# Altium schematic sheet MCU063A_GPIO.SchDoc
size 431 x 279 mm; Date: Not shown in title block; ApprovedBy: Not shown in title block; CheckedBy: Not shown in title block; Author: Not shown in title block; CompanyName: Not shown in title block; DrawnBy: Cody Watkins; Engineer: Not shown in title block; Organization: Not shown in title block; Address1: Not shown in title block; Address2: Not shown in title block; Address3: Not shown in title block; Address4: Not shown in title block; DocumentNumber: 2; Revision: Use project parameter SCH_Rev; SheetNumber: 2; SheetTotal: 11; PageSetup: Record=PageOptions|CenterHorizontal=True|CenterVertical=True|PrintScale=1.00|XCorrection=1.00|YCorrection=1.00|PrintKind=0|BorderSize=5000000|LeftOffset=0|BottomOffset=0|Orientation=2|PaperLength=1000|PaperWidth=1000|Scale=100|PaperSource=15|PrintQuality=600|MediaType=1|DitherType=10|PaperKind=Letter|PrintScaleMode=1; CurrentTime: Not shown in title block; CurrentDate: Not shown in title block; Time: Not shown in title block; DocumentFullPathAndName: Not shown in title block; DocumentName: Not shown in title block; ModifiedDate: Not shown in title block; ImagePath: Not shown in title block
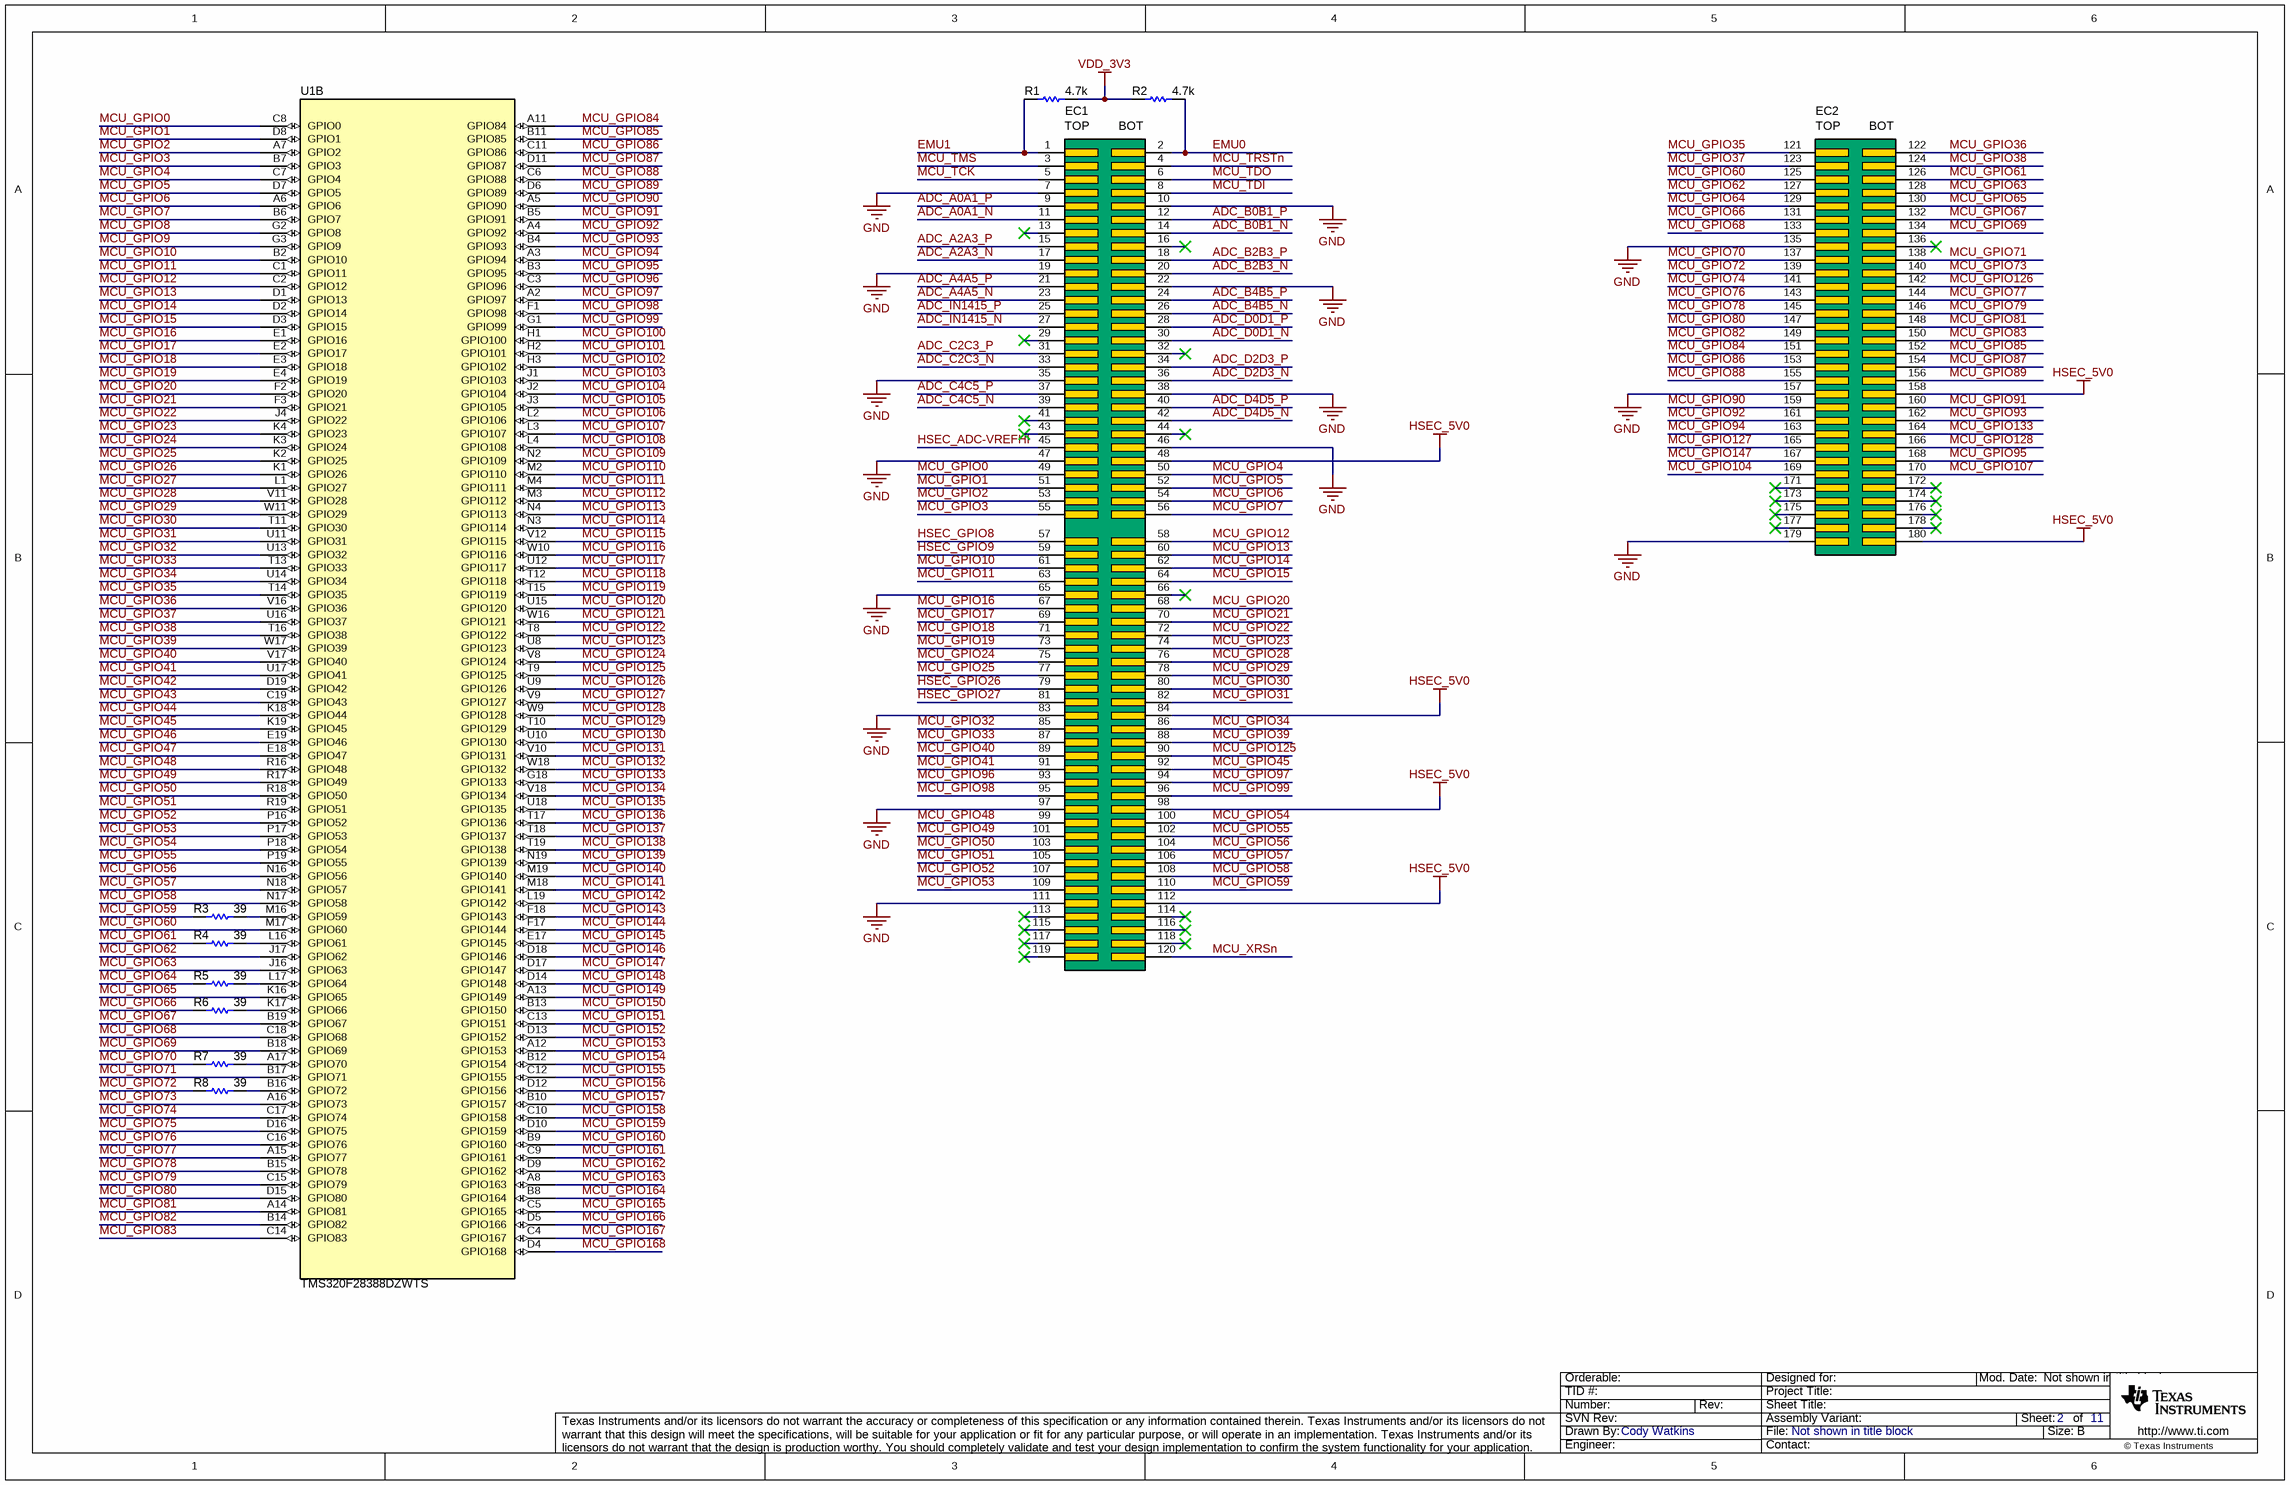
[diagram p0: MCU063A_GPIO.SchDoc]

## Parts
EC1  controlCARD-120HSEC_Edge  [controlCARD-120HSEC_Edge]  (value not drawn)  (no BOM)
EC2  controlCARD-180HSEC-60pinAddon_Edge  [controlCARD-180HSEC-60pinAddon_Edge]  (value not drawn)  (no BOM)
R1  ValueDisplayed: 4.7k  [0402]  (hidden comment: CRCW04024K70JNED)
R2  ValueDisplayed: 4.7k  [0402]  (hidden comment: CRCW04024K70JNED)
R3  ValueDisplayed: 39  [0402]  (hidden comment: CRCW040239R0JNED)
R4  ValueDisplayed: 39  [0402]  (hidden comment: CRCW040239R0JNED)
R5  ValueDisplayed: 39  [0402]  (hidden comment: CRCW040239R0JNED)
R6  ValueDisplayed: 39  [0402]  (hidden comment: CRCW040239R0JNED)
R7  ValueDisplayed: 39  [0402]  (hidden comment: CRCW040239R0JNED)
R8  ValueDisplayed: 39  [0402]  (hidden comment: CRCW040239R0JNED)
U1  TMS320F28388DZWTS  [ZWT0337A]  (part B of 5)

## Nets
GND: EC1.7 EC1.10 EC1.19 EC1.22 EC1.35 EC1.38 EC1.46 EC1.47 EC1.65 EC1.83 EC1.97 EC1.111 EC2.135 EC2.157 EC2.179
HSEC_5V0: EC1.48 EC1.84 EC1.98 EC1.112 EC2.158 EC2.180
VDD_3V3: R1.2 R2.1
ADC_A0A1_N: EC1.11
ADC_A0A1_P: EC1.9
ADC_A2A3_N: EC1.17
ADC_A2A3_P: EC1.15
ADC_A4A5_N: EC1.23
ADC_A4A5_P: EC1.21
ADC_B0B1_N: EC1.14
ADC_B0B1_P: EC1.12
ADC_B2B3_N: EC1.20
ADC_B2B3_P: EC1.18
ADC_B4B5_N: EC1.26
ADC_B4B5_P: EC1.24
ADC_C2C3_N: EC1.33
ADC_C2C3_P: EC1.31
ADC_C4C5_N: EC1.39
ADC_C4C5_P: EC1.37
ADC_D0D1_N: EC1.30
ADC_D0D1_P: EC1.28
ADC_D2D3_N: EC1.36
ADC_D2D3_P: EC1.34
ADC_D4D5_N: EC1.42
ADC_D4D5_P: EC1.40
ADC_IN1415_N: EC1.27
ADC_IN1415_P: EC1.25
EMU0: EC1.2 R2.2
EMU1: EC1.1 R1.1
HSEC_ADC-VREFHI: EC1.45
HSEC_GPIO8: EC1.57
HSEC_GPIO9: EC1.59
HSEC_GPIO26: EC1.79
HSEC_GPIO27: EC1.81
MCU_GPIO0: EC1.49 U1.C8(GPIO0)
MCU_GPIO1: EC1.51 U1.D8(GPIO1)
MCU_GPIO2: EC1.53 U1.A7(GPIO2)
MCU_GPIO3: EC1.55 U1.B7(GPIO3)
MCU_GPIO4: EC1.50 U1.C7(GPIO4)
MCU_GPIO5: EC1.52 U1.D7(GPIO5)
MCU_GPIO6: EC1.54 U1.A6(GPIO6)
MCU_GPIO7: EC1.56 U1.B6(GPIO7)
MCU_GPIO8: U1.G2(GPIO8)
MCU_GPIO9: U1.G3(GPIO9)
MCU_GPIO10: EC1.61 U1.B2(GPIO10)
MCU_GPIO11: EC1.63 U1.C1(GPIO11)
MCU_GPIO12: EC1.58 U1.C2(GPIO12)
MCU_GPIO13: EC1.60 U1.D1(GPIO13)
MCU_GPIO14: EC1.62 U1.D2(GPIO14)
MCU_GPIO15: EC1.64 U1.D3(GPIO15)
MCU_GPIO16: EC1.67 U1.E1(GPIO16)
MCU_GPIO17: EC1.69 U1.E2(GPIO17)
MCU_GPIO18: EC1.71 U1.E3(GPIO18)
MCU_GPIO19: EC1.73 U1.E4(GPIO19)
MCU_GPIO20: EC1.68 U1.F2(GPIO20)
MCU_GPIO21: EC1.70 U1.F3(GPIO21)
MCU_GPIO22: EC1.72 U1.J4(GPIO22)
MCU_GPIO23: EC1.74 U1.K4(GPIO23)
MCU_GPIO24: EC1.75 U1.K3(GPIO24)
MCU_GPIO25: EC1.77 U1.K2(GPIO25)
MCU_GPIO26: U1.K1(GPIO26)
MCU_GPIO27: U1.L1(GPIO27)
MCU_GPIO28: EC1.76 U1.V11(GPIO28)
MCU_GPIO29: EC1.78 U1.W11(GPIO29)
MCU_GPIO30: EC1.80 U1.T11(GPIO30)
MCU_GPIO31: EC1.82 U1.U11(GPIO31)
MCU_GPIO32: EC1.85 U1.U13(GPIO32)
MCU_GPIO33: EC1.87 U1.T13(GPIO33)
MCU_GPIO34: EC1.86 U1.U14(GPIO34)
MCU_GPIO35: EC2.121 U1.T14(GPIO35)
MCU_GPIO36: EC2.122 U1.V16(GPIO36)
MCU_GPIO37: EC2.123 U1.U16(GPIO37)
MCU_GPIO38: EC2.124 U1.T16(GPIO38)
MCU_GPIO39: EC1.88 U1.W17(GPIO39)
MCU_GPIO40: EC1.89 U1.V17(GPIO40)
MCU_GPIO41: EC1.91 U1.U17(GPIO41)
MCU_GPIO42: U1.D19(GPIO42)
MCU_GPIO43: U1.C19(GPIO43)
MCU_GPIO44: U1.K18(GPIO44)
MCU_GPIO45: EC1.92 U1.K19(GPIO45)
MCU_GPIO46: U1.E19(GPIO46)
MCU_GPIO47: U1.E18(GPIO47)
MCU_GPIO48: EC1.99 U1.R16(GPIO48)
MCU_GPIO49: EC1.101 U1.R17(GPIO49)
MCU_GPIO50: EC1.103 U1.R18(GPIO50)
MCU_GPIO51: EC1.105 U1.R19(GPIO51)
MCU_GPIO52: EC1.107 U1.P16(GPIO52)
MCU_GPIO53: EC1.109 U1.P17(GPIO53)
MCU_GPIO54: EC1.100 U1.P18(GPIO54)
MCU_GPIO55: EC1.102 U1.P19(GPIO55)
MCU_GPIO56: EC1.104 U1.N16(GPIO56)
MCU_GPIO57: EC1.106 U1.N18(GPIO57)
MCU_GPIO58: EC1.108 U1.N17(GPIO58)
MCU_GPIO59: EC1.110 R3.1
MCU_GPIO60: EC2.125 U1.M17(GPIO60)
MCU_GPIO61: EC2.126 R4.1
MCU_GPIO62: EC2.127 U1.J17(GPIO62)
MCU_GPIO63: EC2.128 U1.J16(GPIO63)
MCU_GPIO64: EC2.129 R5.1
MCU_GPIO65: EC2.130 U1.K16(GPIO65)
MCU_GPIO66: EC2.131 R6.1
MCU_GPIO67: EC2.132 U1.B19(GPIO67)
MCU_GPIO68: EC2.133 U1.C18(GPIO68)
MCU_GPIO69: EC2.134 U1.B18(GPIO69)
MCU_GPIO70: EC2.137 R7.1
MCU_GPIO71: EC2.138 U1.B17(GPIO71)
MCU_GPIO72: EC2.139 R8.1
MCU_GPIO73: EC2.140 U1.A16(GPIO73)
MCU_GPIO74: EC2.141 U1.C17(GPIO74)
MCU_GPIO75: U1.D16(GPIO75)
MCU_GPIO76: EC2.143 U1.C16(GPIO76)
MCU_GPIO77: EC2.144 U1.A15(GPIO77)
MCU_GPIO78: EC2.145 U1.B15(GPIO78)
MCU_GPIO79: EC2.146 U1.C15(GPIO79)
MCU_GPIO80: EC2.147 U1.D15(GPIO80)
MCU_GPIO81: EC2.148 U1.A14(GPIO81)
MCU_GPIO82: EC2.149 U1.B14(GPIO82)
MCU_GPIO83: EC2.150 U1.C14(GPIO83)
MCU_GPIO84: EC2.151 U1.A11(GPIO84)
MCU_GPIO85: EC2.152 U1.B11(GPIO85)
MCU_GPIO86: EC2.153 U1.C11(GPIO86)
MCU_GPIO87: EC2.154 U1.D11(GPIO87)
MCU_GPIO88: EC2.155 U1.C6(GPIO88)
MCU_GPIO89: EC2.156 U1.D6(GPIO89)
MCU_GPIO90: EC2.159 U1.A5(GPIO90)
MCU_GPIO91: EC2.160 U1.B5(GPIO91)
MCU_GPIO92: EC2.161 U1.A4(GPIO92)
MCU_GPIO93: EC2.162 U1.B4(GPIO93)
MCU_GPIO94: EC2.163 U1.A3(GPIO94)
MCU_GPIO95: EC2.168 U1.B3(GPIO95)
MCU_GPIO96: EC1.93 U1.C3(GPIO96)
MCU_GPIO97: EC1.94 U1.A2(GPIO97)
MCU_GPIO98: EC1.95 U1.F1(GPIO98)
MCU_GPIO99: EC1.96 U1.G1(GPIO99)
MCU_GPIO100: U1.H1(GPIO100)
MCU_GPIO101: U1.H2(GPIO101)
MCU_GPIO102: U1.H3(GPIO102)
MCU_GPIO103: U1.J1(GPIO103)
MCU_GPIO104: EC2.169 U1.J2(GPIO104)
MCU_GPIO105: U1.J3(GPIO105)
MCU_GPIO106: U1.L2(GPIO106)
MCU_GPIO107: EC2.170 U1.L3(GPIO107)
MCU_GPIO108: U1.L4(GPIO108)
MCU_GPIO109: U1.N2(GPIO109)
MCU_GPIO110: U1.M2(GPIO110)
MCU_GPIO111: U1.M4(GPIO111)
MCU_GPIO112: U1.M3(GPIO112)
MCU_GPIO113: U1.N4(GPIO113)
MCU_GPIO114: U1.N3(GPIO114)
MCU_GPIO115: U1.V12(GPIO115)
MCU_GPIO116: U1.W10(GPIO116)
MCU_GPIO117: U1.U12(GPIO117)
MCU_GPIO118: U1.T12(GPIO118)
MCU_GPIO119: U1.T15(GPIO119)
MCU_GPIO120: U1.U15(GPIO120)
MCU_GPIO121: U1.W16(GPIO121)
MCU_GPIO122: U1.T8(GPIO122)
MCU_GPIO123: U1.U8(GPIO123)
MCU_GPIO124: U1.V8(GPIO124)
MCU_GPIO125: EC1.90 U1.T9(GPIO125)
MCU_GPIO126: EC2.142 U1.U9(GPIO126)
MCU_GPIO127: EC2.165 U1.V9(GPIO127)
MCU_GPIO128: EC2.166 U1.W9(GPIO128)
MCU_GPIO129: U1.T10(GPIO129)
MCU_GPIO130: U1.U10(GPIO130)
MCU_GPIO131: U1.V10(GPIO131)
MCU_GPIO132: U1.W18(GPIO132)
MCU_GPIO133: EC2.164 U1.G18(GPIO133)
MCU_GPIO134: U1.V18(GPIO134)
MCU_GPIO135: U1.U18(GPIO135)
MCU_GPIO136: U1.T17(GPIO136)
MCU_GPIO137: U1.T18(GPIO137)
MCU_GPIO138: U1.T19(GPIO138)
MCU_GPIO139: U1.N19(GPIO139)
MCU_GPIO140: U1.M19(GPIO140)
MCU_GPIO141: U1.M18(GPIO141)
MCU_GPIO142: U1.L19(GPIO142)
MCU_GPIO143: U1.F18(GPIO143)
MCU_GPIO144: U1.F17(GPIO144)
MCU_GPIO145: U1.E17(GPIO145)
MCU_GPIO146: U1.D18(GPIO146)
MCU_GPIO147: EC2.167 U1.D17(GPIO147)
MCU_GPIO148: U1.D14(GPIO148)
MCU_GPIO149: U1.A13(GPIO149)
MCU_GPIO150: U1.B13(GPIO150)
MCU_GPIO151: U1.C13(GPIO151)
MCU_GPIO152: U1.D13(GPIO152)
MCU_GPIO153: U1.A12(GPIO153)
MCU_GPIO154: U1.B12(GPIO154)
MCU_GPIO155: U1.C12(GPIO155)
MCU_GPIO156: U1.D12(GPIO156)
MCU_GPIO157: U1.B10(GPIO157)
MCU_GPIO158: U1.C10(GPIO158)
MCU_GPIO159: U1.D10(GPIO159)
MCU_GPIO160: U1.B9(GPIO160)
MCU_GPIO161: U1.C9(GPIO161)
MCU_GPIO162: U1.D9(GPIO162)
MCU_GPIO163: U1.A8(GPIO163)
MCU_GPIO164: U1.B8(GPIO164)
MCU_GPIO165: U1.C5(GPIO165)
MCU_GPIO166: U1.D5(GPIO166)
MCU_GPIO167: U1.C4(GPIO167)
MCU_GPIO168: U1.D4(GPIO168)
MCU_TCK: EC1.5
MCU_TDI: EC1.8
MCU_TDO: EC1.6
MCU_TMS: EC1.3
MCU_TRSTn: EC1.4
MCU_XRSn: EC1.120
NetR3_2: R3.2 U1.M16(GPIO59)
NetR4_2: R4.2 U1.L16(GPIO61)
NetR5_2: R5.2 U1.L17(GPIO64)
NetR6_2: R6.2 U1.K17(GPIO66)
NetR7_2: R7.2 U1.A17(GPIO70)
NetR8_2: R8.2 U1.B16(GPIO72)

Not connected (* = marked no-connect by the designer): EC1 13* 16* 29* 32* 41* 43* 44* 66* 113* 114* 115* 116* 117* 118* 119*; EC2 136* 171* 172* 173* 174* 175* 176* 177* 178*

## Notes on the sheet
- Drawn By:
- SVN Rev:
- Number:
- TID #:
- Orderable:
- Rev:
- Sheet Title:
- File:
- Project Title:
- Designed for:
- Assembly Variant:
- Mod. Date:
- Sheet:
- Size:
- of
- B
- http://www.ti.com
- Texas Instruments and/or its licensors do not warrant the accuracy or completeness of this specification or any information contained therein. Texas Instruments and/or its licensors do not warrant that this design will meet the specifications, will be suitable for your application or fit for any particular purpose, or will operate in an implementation. Texas Instruments and/or its licensors do not warrant that the design is production worthy. You should completely validate and test your design implementation to confirm the system functionality for your application.
- Engineer:
- Contact:
- © Texas Instruments
- (in symbol CMP-0003813-2) TOP; BOT
- (in symbol CMP-0081961-1) TOP; BOT

## Library data of the parts
EC1 = CMP-0003813-2: C2000 controlCARD-120HSEC Edge Connector for Samtec HSEC8-160-01-L-DV-A-BL; Manufacturer: Any; Note: The pin numbering does not match Samtec datasheet; CompType: Edge Connector; PackageReference: C2000 pin numbering for edge connetor; MountType: N/A; PartNumber: controlCARD-120HSEC_Edge
EC2 = CMP-0081961-1: C2000 controlCARD-180HSEC (60-pin addon) Edge connector for Samtec HSEC8-130-01-L-DV-A; Manufacturer: Any; Note: The pin numbering does not match Samtec datasheet; CompType: Edge Connector; PartNumber: controlCARD-180HSEC-60pinAddon_Edge; MountType: N/A
R1 R2 = CMP-0026938-5: RES, 4.7 k, 5%, 0.063 W, AEC-Q200 Grade 0, 0402; Manufacturer: Vishay-Dale; Power_W: 63mW; TempCo: 200 ppm/C; Value_Code: 4k70; Value: 4.7k; EIA_Code: E24; SizeX_mm: 1; SizeY_mm: 0.5; SizeZ_mm: 0.6; Value2: 0.063W; AEC Qualified: Y; VDC_V: 50V; AEC Category: Q200; AEC Grade: 0; Supplier Part Number 2: 59M6733; Supplier 2: Newark; Supplier Part Number 3: 71-CRCW0402J-4.7K-E3; Supplier 3: Mouser; RoHS: E; Value1: 5%; MountType: SMT; Supplier 1: Digi-Key; PackageReference: 0402; Tolerance_%: 5%; Res_ohm: 4.7k; SizeArea_mm2: 0.5; CompType: Resistor; PartNumber: CRCW04024K70JNED; ComponentLink1Description: Datasheet link; Supplier Part Number 1: 541-4.7KJCT-ND; Technology: Thick Film; ComponentLink1URL: http://www.vishay.com/docs/20035/dcrcwe3.pdf
R3-R8 = CMP-0026916-3: RES, 39, 5%, 0.063 W, AEC-Q200 Grade 0, 0402; Manufacturer: Vishay-Dale; Power_W: 63mW; TempCo: 200 ppm/C; Value_Code: 39R0; Value: 39; EIA_Code: E24; SizeX_mm: 1; SizeY_mm: 0.5; SizeZ_mm: 0.6; Value2: 0.063W; AEC Qualified: Y; VDC_V: 50V; AEC Category: Q200; AEC Grade: 0; Supplier Part Number 2: 89M6649; Supplier 2: Newark; Supplier Part Number 3: 71-CRCW0402J-39-E3; Supplier 3: Mouser; RoHS: E; Value1: 5%; MountType: SMT; Supplier 1: Digi-Key; PackageReference: 0402; Tolerance_%: 5%; Res_ohm: 39; SizeArea_mm2: 0.5; CompType: Resistor; PartNumber: CRCW040239R0JNED; ComponentLink1Description: Datasheet link; Supplier Part Number 1: 541-39JCT-ND; Technology: Thick Film; ComponentLink1URL: http://www.vishay.com/docs/20035/dcrcwe3.pdf
U1 = CMP-0081777-3: TMS320F28388DZWTS, ZWT0337A (NFBGA-337); Manufacturer: Texas Instruments; SizeAreaWB_mm2: 324; SizeArea_mm2: 256; AEC Qualified: N; AEC Category: Q200; SizeZ_mm: 1.4; SizeY_mm: 16; CompType: IC; ComponentLink1Description: Datasheet Link; ComponentLink2Description: Product Folder; PackageReference: ZWT0337A; PartNumber: TMS320F28388DZWTS; PackageDescription: NFBGA-337; ComponentLink2URL: http://www.ti.com/product/tms320f28388d; Alternate Manufacturer: Texas Instruments; ComponentLink3URL: http://www.ti.com/product/tms320f28388d/datasheet; ComponentLink1URL: http://www.ti.com/lit/ds/symlink/tms320f28388d.pdf; MountType: SMT; ComponentLink3Description: Online Datasheet; SizeX_mm: 16